# Altium schematic sheet Power Page 1.SchDoc
size 406 x 304 mm; SheetNumber: 12; SheetTotal: 14
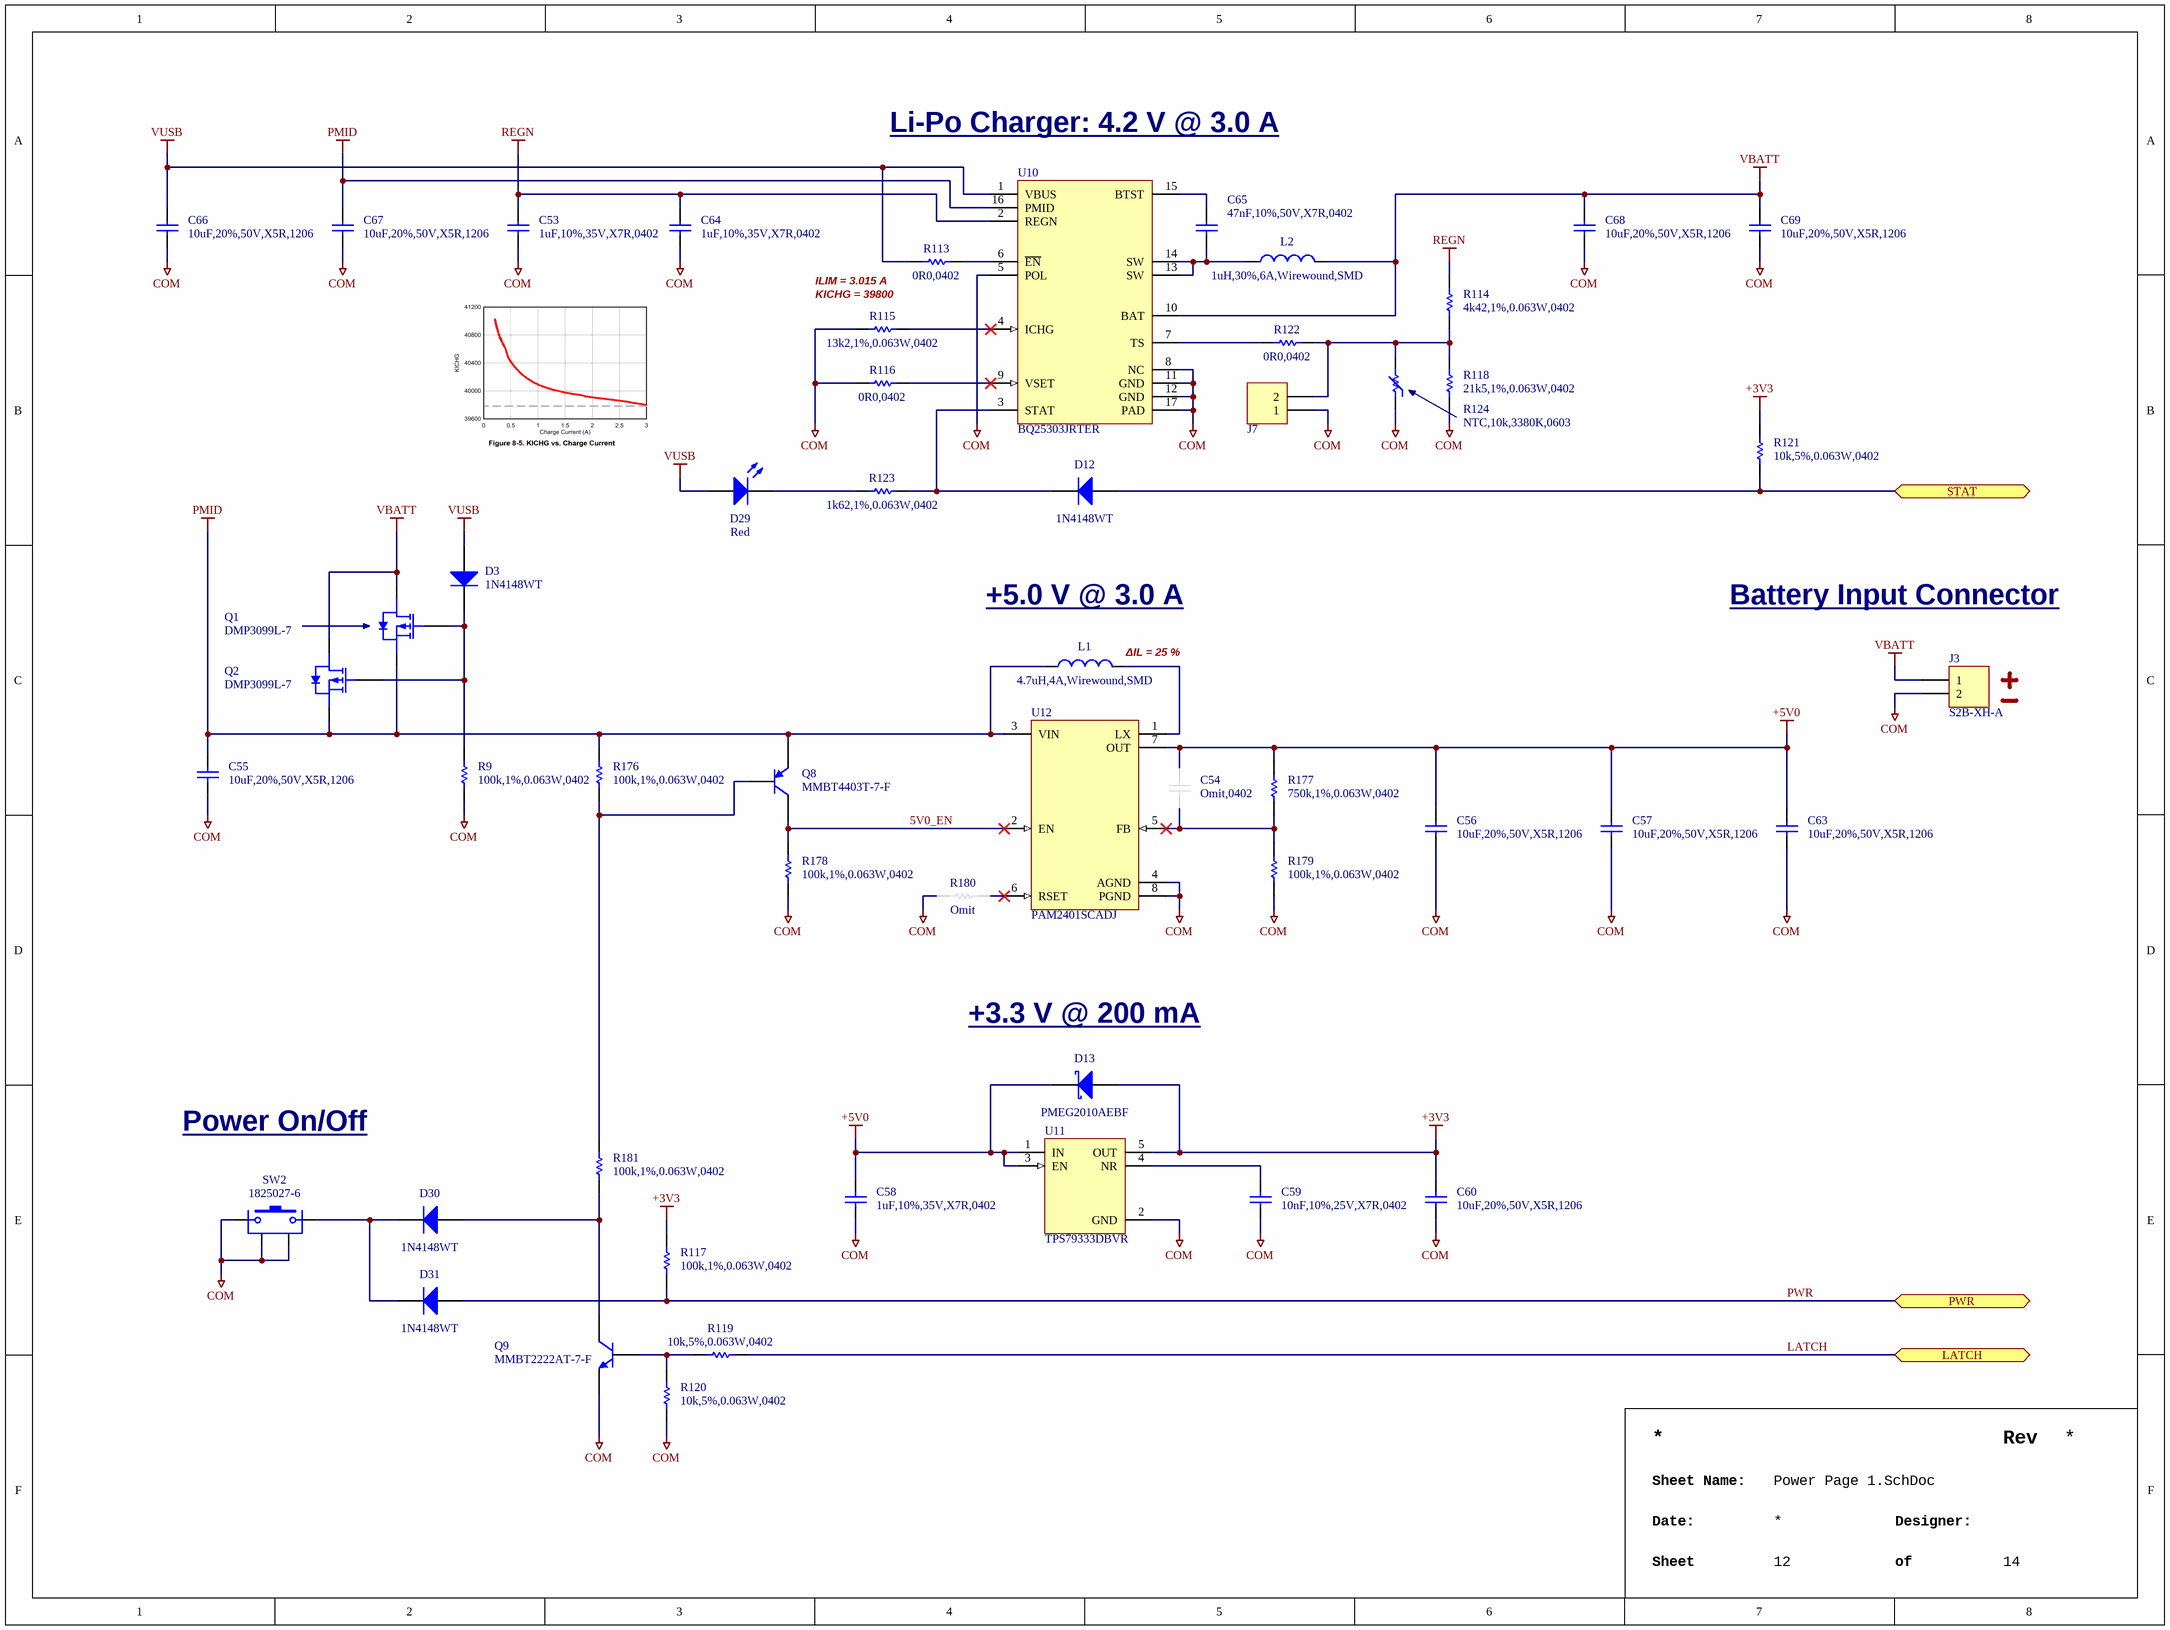
[diagram p0: Power Page 1.SchDoc]

## Parts
C53  1uF,10%,35V,X7R,0402  [CAPC1005X06N]
C54  Omit,0402  [CAPC1005X06N]  (no BOM)
C55  10uF,20%,50V,X5R,1206  [CAPC3216X16N]
C56  10uF,20%,50V,X5R,1206  [CAPC3216X16N]
C57  10uF,20%,50V,X5R,1206  [CAPC3216X16N]
C58  1uF,10%,35V,X7R,0402  [CAPC1005X06N]
C59  10nF,10%,25V,X7R,0402  [CAPC1005X06N]
C60  10uF,20%,50V,X5R,1206  [CAPC3216X16N]
C63  10uF,20%,50V,X5R,1206  [CAPC3216X16N]
C64  1uF,10%,35V,X7R,0402  [CAPC1005X06N]
C65  47nF,10%,50V,X7R,0402  [CAPC1005X06N]
C66  10uF,20%,50V,X5R,1206  [CAPC3216X16N]
C67  10uF,20%,50V,X5R,1206  [CAPC3216X16N]
C68  10uF,20%,50V,X5R,1206  [CAPC3216X16N]
C69  10uF,20%,50V,X5R,1206  [CAPC3216X16N]
D3  1N4148WT  [ONSEMI_PKG_SOD-523F]
D12  1N4148WT  [ONSEMI_PKG_SOD-523F]
D13  PMEG2010AEBF  [NEXPERIA_PKG_SOD523]
D29  Red  [LITE-ON_LTST-C190KRKT]
D30  1N4148WT  [ONSEMI_PKG_SOD-523F]
D31  1N4148WT  [ONSEMI_PKG_SOD-523F]
J3  S2B-XH-A  [JST_S2B-XH-A]
J7  Term,Header,2 Pin,Top,2.54mm  [WURTH_61300211121]  (value not drawn)
L1  4.7uH,4A,Wirewound,SMD  [TAIYO-YUDEN_NRS8030T4R7MJGJ]
L2  1uH,30%,6A,Wirewound,SMD  [TDK_VLS6045EX]
Q1  DMP3099L-7  [DIODES_SOT23]
Q2  DMP3099L-7  [DIODES_SOT23]
Q8  MMBT4403T-7-F  [DIODES_SOT523]
Q9  MMBT2222AT-7-F  [SOTFL50P160X90-3N]
R9  100k,1%,0.063W,0402  [RESC1005X04N]
R113  0R0,0402  [RESC1005X04N]
R114  4k42,1%,0.063W,0402  [RESC1005X04N]
R115  13k2,1%,0.063W,0402  [RESC1005X04N]
R116  0R0,0402  [RESC1005X04N]
R117  100k,1%,0.063W,0402  [RESC1005X04N]
R118  21k5,1%,0.063W,0402  [RESC1005X04N]
R119  10k,5%,0.063W,0402  [RESC1005X04N]
R120  10k,5%,0.063W,0402  [RESC1005X04N]
R121  10k,5%,0.063W,0402  [RESC1005X04N]
R122  0R0,0402  [RESC1005X04N]
R123  1k62,1%,0.063W,0402  [RESC1005X04N]
R124  NTC,10k,3380K,0603  [RESC_0603]
R176  100k,1%,0.063W,0402  [RESC1005X04N]
R177  750k,1%,0.063W,0402  [RESC1005X04N]
R178  100k,1%,0.063W,0402  [RESC1005X04N]
R179  100k,1%,0.063W,0402  [RESC1005X04N]
R180  Omit  [RESC1005X04N]  (no BOM)
R181  100k,1%,0.063W,0402  [RESC1005X04N]
SW2  1825027-6  [TE_1825027-6]
U10  BQ25303JRTER  [TEXASINSTRUMENTS_PKG_RTE0016C]
U11  TPS79333DBVR  [TEXASINSTRUMENTS_PKG_DBV0005A]
U12  PAM2401SCADJ  [DIODES_PKG_MSOP-8]

## Ports
LATCH (bidir), PWR (bidir), STAT (bidir)

## Nets
+3V3: C60.2 D13.2(A) R117.2 R121.1 U11.5(OUT)
+5V0: C54.2 C56.2 C57.2 C58.2 C63.2 D13.1(K) R177.2 U11.1(IN) U11.3(EN) U12.7(OUT)
COM: C53.1 C55.1 C56.1 C57.1 C58.1 C59.1 C60.1 C63.1 C64.1 C66.1 C67.1 C68.1 C69.1 J3.2 J7.1 Q9.2(E) R9.1 R115.1 R116.2 R118.1 R120.2 R124.1 R178.1 R179.1 R180.1 SW2.0 SW2.1 U10.5(POL) U10.8(NC) U10.11(GND) U10.12(GND) U10.17(PAD) U11.2(GND) U12.4(AGND) U12.8(PGND)
PMID: C55.2 C67.2 L1.1 Q1.2(S) Q2.2(S) Q8.2(E) R176.1 U10.16(PMID) U12.3(VIN)
REGN: C53.2 C64.2 R114.2 U10.2(REGN)
VBATT: C68.2 C69.2 J3.1 L2.1 Q1.3(D) Q2.3(D) U10.10(BAT)
VUSB: C66.2 D3.2(A) D29.A R113.2 U10.1(VBUS)
5V0_EN: Q8.3(C) R178.2 U12.2(EN)
LATCH: R119.1 ; port LATCH
PWR: D31.2(A) R117.1 ; port PWR
STAT: D12.2(A) R121.2 ; port STAT
NetC54_1: C54.1 R177.1 R179.2 U12.5(FB)
NetC59_2: C59.2 U11.4(NR)
NetC65_1: C65.1 L2.2 U10.13(SW) U10.14(SW)
NetC65_2: C65.2 U10.15(BTST)
NetD3_1: D3.1(K) Q1.1(G) Q2.1(G) R9.2
NetD12_1: D12.1(K) R123.1 U10.3(STAT)
NetD29_C: D29.C R123.2
NetD30_1: D30.1(K) D31.1(K) SW2.2
NetD30_2: D30.2(A) Q9.3(C) R181.2
NetJ7_2: J7.2 R114.1 R118.2 R122.1 R124.2
NetL1_2: L1.2 U12.1(LX)
NetQ8_1: Q8.1(B) R176.2 R181.1
NetQ9_1: Q9.1(B) R119.2 R120.1
NetR113_1: R113.1 U10.6(~{EN})
NetR115_2: R115.2 U10.4(ICHG)
NetR116_1: R116.1 U10.9(VSET)
NetR122_2: R122.2 U10.7(TS)
NetR180_2: R180.2 U12.6(RSET)

## Notes on the sheet
- Li-Po Charger: 4.2 V @ 3.0 A
- ILIM = 3.015 A
- (near R115) KICHG = 39800
- +5.0 V @ 3.0 A
- Battery Input Connector
- (near L1) ΔIL = 25 %
- +3.3 V @ 200 mA
- Power On/Off
- Rev
- Sheet Name:
- Date:
- Sheet
- Designer:
- of

## Library data of the parts
C53 C58 C64 = CAP,Cer,1uF,35VDC,X5R,0402: 1 ï¿½F ï¿½10% 35V Ceramic Capacitor X5R 0402 (1005 Metric); Manufacturer 1: TDK Corporation; Manufacturer 1 Part Number: C1005X5R1V105K050BC; Vendor 1 Part Number: 445-9073-1-ND; Vendor 1: Digikey; Value: 1u; Part Name: CAP,Cer,1uF,35VDC,X5R,0402; CreatedBy: Judd Foster; HelpURL: https://product.tdk.com/info/en/catalog/datasheets/mlcc_commercial_general_en.pdf?ref_disty=digikey
C54 = CAP,Omit,0402: Omit; Part Name: CAP,Omit,0402; CreatedBy: Judd Foster; HelpURL: N/A; Manufacturer 1: N/A; Manufacturer 1 Part Number: N/A; Vendor 1: N/A; Vendor 1 Part Number: N/A; Value: Omit
C55-C57 C60 C63 C66-C69 = CAP,Cer,10uF,50VDC,X5R,1206: 10ï¿½F ï¿½20% 50V Ceramic Capacitor X5R 1206 (3216 Metric); Manufacturer 1: Samsung Electro-Mechanics; Manufacturer 1 Part Number: CL31A106MBHNNNE; Vendor 1 Part Number: 1276-6736-1-ND; Vendor 1: Digikey; Value: 10u; Part Name: CAP,Cer,10uF,50VDC,X5R,1206; CreatedBy: Judd Foster; HelpURL: https://www.samsungsem.com/resources/file/global/support/product_catalog/MLCC.pdf
C59 = CAP,Cer,10nF,10%,25V,X7R,0402: 10000pF ï¿½10% 25V Ceramic Capacitor X7R 0402 (1005 Metric); Manufacturer 1: Murata Electronics; Manufacturer 1 Part Number: GCM155R71E103KA37D; Vendor 1 Part Number: 490-6043-1-ND; Vendor 1: Digikey; Value: 10n; Part Name: CAP,Cer,10nF,10%,25V,X7R,0402; CreatedBy: Judd Foster; HelpURL: https://psearch.en.murata.com/capacitor/product/GCM155R71E103KA37%23.pdf
C65 = CAP,Cer,47nF,10%,50V,X7R,0402: 50V 47nF X7R Â±10% 0402 Multilayer Ceramic Capacitors MLCC - SMD/SMT ROHS; Manufacturer 1: YAGEO; Manufacturer 1 Part Number: CC0402KRX7R9BB473; Vendor 1 Part Number: C272875; Vendor 1: LCSC; Value: 47n; Part Name: CAP,Cer,47nF,10%,50V,X7R,0402; CreatedBy: Judd Foster; HelpURL: https://www.lcsc.com/datasheet/C272875.pdf
D3 D12 D30 D31 = DIODE,Gen,75V,150mA,SOD523F: Diode 75 V 200mA Surface Mount SOD-523F; Manufacturer 1: onsemi; Vendor 1 Part Number: 1N4148WTCT-ND; Vendor 1: DigiKey; Part Name: DIODE,Gen,75V,150mA,SOD523F; CreatedBy: Judd Foster; HelpURL: https://mm.digikey.com/Volume0/opasdata/d220001/medias/docus/6621/1N914BWTCND.pdf; Manufacturer 1 Part Number: 1N4148WT
D13 = DIODE,Schottky,20V,1A,SOD523: Diode 20 V 1A Surface Mount SOD-523; Manufacturer 1: Nexperia USA Inc.; Vendor 1 Part Number: 1727-8539-1-ND; Vendor 1: DigiKey; Part Name: DIODE,Schottky,20V,1A,SOD523; CreatedBy: Judd Foster; HelpURL: https://assets.nexperia.com/documents/data-sheet/PMEG2010AEB.pdf; Manufacturer 1 Part Number: PMEG2010AEBF
D29 = LED,Red,SMD,0603: Red 631nm LED Indication - Discrete 2V 0603 (1608 Metric); Manufacturer 1: Lite-On Inc.; Manufacturer 1 Part Number: LTST-C190KRKT; Vendor 1 Part Number: 160-1436-1-ND; Vendor 1: Digikey; Part Name: LED,Red,SMD,0603; CreatedBy: Judd Foster; HelpURL: https://optoelectronics.liteon.com/upload/download/DS-22-99-0151/LTST-C190KRKT.pdf; Value: Red
J3 = Conn,JST,2Pin,2.5mm,RA,Thru: Connector Header Through Hole, Right Angle 2 position 0.098" (2.50mm); Manufacturer 1: JST Sales America Inc.; Vendor 1 Part Number: 455-S2B-XH-A-ND; Vendor 1: DigiKey; Part Name: Conn,JST,2Pin,2.5mm,RA,Thru; CreatedBy: Judd Foster; HelpURL: https://www.jst-mfg.com/product/pdf/eng/eXH.pdf; Manufacturer 1 Part Number: S2B-XH-A
J7 = Term,Header,2 Pin,Top,2.54mm: Connector Header Through Hole 2 position 0.100" (2.54mm); Manufacturer 1: WÃ¼rth Elektronik; Manufacturer 1 Part Number: 61300211121; Vendor 1 Part Number: 732-5315-ND; Vendor 1: DigiKey; Part Name: Term,Header,2 Pin,Top,2.54mm; CreatedBy: Judd Foster; HelpURL: https://www.we-online.com/components/products/datasheet/61300211121.pdf
L1 = IND,4.7uH,4A,Wirewound,SMD: 4.7 ÂµH Shielded Drum Core, Wirewound Inductor 4 A 28.6mOhm Max Nonstandard; Manufacturer 1: Taiyo Yuden; Manufacturer 1 Part Number: NRS8030T4R7MJGJ; Vendor 1 Part Number: 587-2969-1-ND; Vendor 1: DigiKey; Value: 4.7u; Part Name: IND,4.7uH,4A,Wirewound,SMD; CreatedBy: Judd Foster; HelpURL: https://mm.digikey.com/Volume0/opasdata/d220001/medias/docus/610/NRS8030T4R7MJGJ_SS.pdf
L2 = IND,1uH,30%,6A,Wirewound,SMD: VLS6045EX-1R0N; Manufacturer 1: TDK; Vendor 1 Part Number: C404500; Vendor 1: LCSC; Part Name: IND,1uH,30%,6A,Wirewound,SMD; CreatedBy: Judd Foster; HelpURL: https://www.lcsc.com/datasheet/C404500.pdf; Manufacturer 1 Part Number: VLS6045EX-1R0N
Q1 Q2 = MOSFET,P Ch,30V,3.8A: P-Channel 30 V 3.8A (Ta) 1.08W (Ta) Surface Mount SOT-23-3; Manufacturer 1: Diodes Incorporated; Vendor 1 Part Number: DMP3099L-7DICT-ND; Vendor 1: Digikey; Part Name: MOSFET,P Ch,30V,3.8A; CreatedBy: Judd Foster; HelpURL: https://www.diodes.com/assets/Datasheets/DMP3099L.pdf; Manufacturer 1 Part Number: DMP3099L-7
Q8 = Trans,PNP,40V,600mA,SOT523: Bipolar (BJT) Transistor PNP 40 V 600 mA 200MHz 150 mW Surface Mount SOT-523; Manufacturer 1: Diodes Incorporated; Vendor 1 Part Number: MMBT4403T-FDICT-ND; Vendor 1: Digikey; Part Name: Trans,PNP,40V,600mA,SOT523; CreatedBy: Judd Foster; HelpURL: https://www.diodes.com/assets/Datasheets/ds30273.pdf; Manufacturer 1 Part Number: MMBT4403T-7-F
Q9 = Trans,NPN,40V,600mA,SOT523: Bipolar (BJT) Transistor NPN 40 V 600 mA 300MHz 150 mW Surface Mount SOT-523; Manufacturer 1: Diodes Incorporated; Vendor 1 Part Number: MMBT2222AT-FDICT-ND; Vendor 1: Digikey; Part Name: Trans,NPN,40V,600mA,SOT523; CreatedBy: Judd Foster; HelpURL: https://media.digikey.com/pdf/Data%20Sheets/Diodes%20PDFs/MMBT2222AT_Rev2016.pdf; Manufacturer 1 Part Number: MMBT2222AT-7-F
R9 R117 R176 R178 R179 R181 = RES,100k,1%,0.063W,0402: 100 kOhms Â±1% 0.063W, 1/16W Chip Resistor 0402 (1005 Metric) Moisture Resistant Thick Film; Manufacturer 1: YAGEO; Manufacturer 1 Part Number: RC0402FR-07100KL; Vendor 1 Part Number: 311-100KLRCT-ND; Vendor 1: DigiKey; Part Name: RES,100k,1%,0.063W,0402; CreatedBy: Judd Foster; HelpURL: https://www.yageo.com/upload/media/product/products/datasheet/rchip/PYu-RC_Group_51_RoHS_L_12.pdf; Value: 100k
R113 R116 R122 = RES,0R0,0402: 0 Ohms Jumper 0.1W, 1/10W Chip Resistor 0402 (1005 Metric) Automotive AEC-Q200 Thick Film; Manufacturer 1: Panasonic Electronic Components; Manufacturer 1 Part Number: ERJ-2GE0R00X; Vendor 1 Part Number: P0.0JCT-ND; Vendor 1: Digikey; Value: 0; Part Name: RES,0R0,0402; CreatedBy: Judd Foster; HelpURL: https://industrial.panasonic.com/cdbs/www-data/pdf/RDA0000/AOA0000C301.pdf
R114 = RES,4k42,1%,0.063W,0402: 62.5mW 4.42kÎ© 50V Â±100ppm/â„ƒ Thick Film Resistor Â±1% 0402 Chip Resistor - Surface Mount ROHS; Manufacturer 1: FOJAN; Manufacturer 1 Part Number: FRC0402F4421TS; Vendor 1 Part Number: C3013170; Vendor 1: LCSC; Part Name: RES,4k42,1%,0.063W,0402; CreatedBy: Judd Foster; HelpURL: https://www.lcsc.com/datasheet/C3013170.pdf; Value: 4k42
R115 = RES,13k2,1%,0.063W,0402: 13.2 kOhms Â±1% 0.063W, 1/16W Chip Resistor 0402 (1005 Metric) Automotive AEC-Q200, Moisture Resistant Metal Film; Manufacturer 1: KOA Speer Electronics, Inc.; Manufacturer 1 Part Number: RN73H1ETTP1322F25; Vendor 1 Part Number: 2019-RN73H1ETTP1322F25CT-ND; Vendor 1: DigiKey; Part Name: RES,13k2,1%,0.063W,0402; CreatedBy: Judd Foster; HelpURL: https://www.koaspeer.com/pdfs/RN73H.pdf
R118 = RES,21k5,1%,0.063W,0402: 21.5kÎ© 62.5mW 50V Â±100ppm/â„ƒ Thick Film Resistor Â±1% 0402 Chip Resistor - Surface Mount ROHS; Manufacturer 1: FOJAN; Manufacturer 1 Part Number: FRC0402F2152TS; Vendor 1 Part Number: C2933081; Vendor 1: LCSC; Part Name: RES,21k5,1%,0.063W,0402; CreatedBy: Judd Foster; HelpURL: https://www.lcsc.com/datasheet/C2933081.pdf; Value: 21k5
R119-R121 = RES,10k,5%,0.063W,0402: 10 kOhms ï¿½5% 0.063W, 1/16W Chip Resistor 0402 (1005 Metric) Automotive AEC-Q200 Thick Film; Manufacturer 1: Stackpole Electronics Inc; Manufacturer 1 Part Number: RMCF0402JT10K0; Vendor 1 Part Number: RMCF0402JT10K0CT-ND; Vendor 1: DIgikey; Part Name: RES,10k,5%,0.063W,0402; CreatedBy: Judd Foster; HelpURL: https://www.seielect.com/catalog/sei-rmcf_rmcp.pdf; Value: 10k
R123 = RES,1k62,1%,0.063W,0402: 1.62 kOhms Â±1% 0.063W, 1/16W Chip Resistor 0402 (1005 Metric) Moisture Resistant Thick Film; Manufacturer 1: YAGEO; Manufacturer 1 Part Number: RC0402FR-071K62L; Vendor 1 Part Number: YAG3042CT-ND; Vendor 1: DigiKey; Part Name: RES,1k62,1%,0.063W,0402; CreatedBy: Judd Foster; HelpURL: https://www.yageo.com/upload/media/product/products/datasheet/rchip/PYu-RC_Group_51_RoHS_L_12.pdf; Value: 1k62
R124 = RES,Thermistor,NTC,10k,3380K,0603: 10kÎ© 100mW Â±1% 310uA 3380K Â±1% 0603 NTC Thermistors ROHS; Manufacturer 1: Murata; Manufacturer 1 Part Number: NCP18XH103F03RB; Vendor 1 Part Number: C13564; Vendor 1: LCSC; Part Name: RES,Thermistor,NTC,10k,3380K,0603; CreatedBy: Judd Foster; HelpURL: https://www.lcsc.com/datasheet/C13564.pdf
R177 = RES,750k,1%,0.063W,0402: 750 kOhms ï¿½1% 0.063W, 1/16W Chip Resistor 0402 (1005 Metric) Moisture Resistant Thick Film; Manufacturer 1: YAGEO; Manufacturer 1 Part Number: RC0402FR-07750KL; Vendor 1 Part Number: YAG3228CT-ND; Vendor 1: Digikey; Part Name: RES,750k,1%,0.063W,0402; CreatedBy: Judd Foster; HelpURL: https://www.yageo.com/upload/media/product/app/datasheet/rchip/pyu-rc_group_51_rohs_l.pdf; Value: 750k,1%,0.063W,0402
R180 = RES,Omit,0402: Part Name: RES,Omit,0402; CreatedBy: Judd Foster; HelpURL: N/A; Manufacturer 1: N/A; Manufacturer 1 Part Number: N/A; Vendor 1: N/A; Vendor 1 Part Number: N/A; Value: Omit
SW2 = Switch,Tactile,SPST-NO,RA,Thru: 24V With Bracket Round Button SPST 50mA Through Hole Tactile Switches RoHS; Manufacturer 1: TE Connectivity; Vendor 1 Part Number: C2928196; Vendor 1: LCSC; Part Name: Switch,Tactile,SPST-NO,RA,Thru; CreatedBy: Judd Foster; HelpURL: https://www.lcsc.com/datasheet/C2928196.pdf; Manufacturer 1 Part Number: 1825027-6
U10 = BQ25303JRTER: Charger IC Lithium Ion/Polymer 16-WQFN (3x3); Manufacturer 1: Texas Instruments; Vendor 1 Part Number: 296-BQ25303JRTERCT-ND; Vendor 1: DigiKey; Part Name: BQ25303JRTER; CreatedBy: Judd Foster; HelpURL: https://www.ti.com/lit/ds/symlink/bq25303j.pdf?HQS=dis-dk-null-digikeymode-dsf-pf-null-wwe&ts=1761554135734; Manufacturer 1 Part Number: BQ25303JRTER
U11 = TPS79333DBVR: 70dB@(10kHz) Positive Fixed 3.3V SOT-23-5 Voltage Regulators - Linear, Low Drop Out (LDO) Regulators ROHS; Manufacturer 1: Texas Instruments; Vendor 1 Part Number: C9840; Vendor 1: LCSC; Part Name: TPS79333DBVR; CreatedBy: Judd Foster; HelpURL: https://www.lcsc.com/datasheet/C9840.pdf; Manufacturer 1 Part Number: TPS79333DBVR
U12 = PAM2401SCADJ: Boost Switching Regulator IC Positive Adjustable 2.5V 1 Output 1A 8-TSSOP, 8-MSOP (0.118", 3.00mm Width); Manufacturer 1: Diodes Incorporated; Vendor 1 Part Number: PAM2401SCADJDICT-ND; Vendor 1: DigiKey; Part Name: PAM2401SCADJ; CreatedBy: Judd Foster; HelpURL: https://www.diodes.com/assets/Datasheets/PAM2401.pdf; Manufacturer 1 Part Number: PAM2401SCADJ